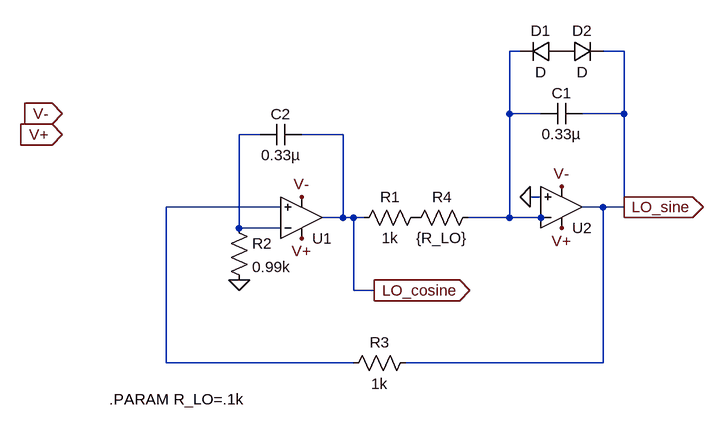
[diagram p0: schematic LocalOscillator.asc]
LocalOscillator.asc, the LTspice schematic file:
Version 4
SHEET 1 880 680
WIRE 448 -256 432 -256
WIRE 608 -256 576 -256
WIRE 432 -160 432 -256
WIRE 480 -160 432 -160
WIRE 608 -160 608 -256
WIRE 608 -160 544 -160
WIRE 48 -128 16 -128
WIRE 176 -128 112 -128
WIRE 480 -32 464 -32
WIRE 80 -16 -96 -16
WIRE 576 -16 544 -16
WIRE 608 -16 608 -160
WIRE 608 -16 576 -16
WIRE 176 0 176 -128
WIRE 176 0 144 0
WIRE 192 0 176 0
WIRE 208 0 192 0
WIRE 432 0 432 -160
WIRE 432 0 368 0
WIRE 480 0 480 -16
WIRE 480 0 432 0
WIRE 16 16 16 -128
WIRE 80 16 16 16
WIRE 192 112 192 0
WIRE 224 112 192 112
WIRE -96 224 -96 -16
WIRE 192 224 -96 224
WIRE 576 224 576 -16
WIRE 576 224 272 224
FLAG 16 96 0
FLAG 464 -32 0
FLAG 112 -32 V-
FLAG 512 -48 V-
FLAG 112 32 V+
FLAG 512 16 V+
FLAG 224 112 LO_cosine
IOPIN 224 112 Out
FLAG 608 -16 LO_sine
IOPIN 608 -16 Out
FLAG -256 -128 V+
IOPIN -256 -128 In
FLAG -256 -160 V-
IOPIN -256 -160 In
SYMBOL Opamps\\UniversalOpamp2 112 0 M180
SYMATTR InstName U1
SYMBOL res 304 -16 R90
WINDOW 0 0 56 VBottom 2
WINDOW 3 32 56 VTop 2
SYMATTR InstName R1
SYMATTR Value 1k
SYMBOL Opamps\\UniversalOpamp2 512 -16 M180
SYMATTR InstName U2
SYMBOL cap 544 -176 R90
WINDOW 0 0 32 VBottom 2
WINDOW 3 32 32 VTop 2
SYMATTR InstName C1
SYMATTR Value 0.33µ
SYMBOL diode 512 -272 R90
WINDOW 0 0 32 VBottom 2
WINDOW 3 32 32 VTop 2
SYMATTR InstName D1
SYMBOL diode 512 -240 R270
WINDOW 0 32 32 VTop 2
WINDOW 3 0 32 VBottom 2
SYMATTR InstName D2
SYMBOL cap 112 -144 R90
WINDOW 0 0 32 VBottom 2
WINDOW 3 32 32 VTop 2
SYMATTR InstName C2
SYMATTR Value 0.33µ
SYMBOL res 0 0 R0
SYMATTR InstName R2
SYMATTR Value 0.99k
SYMBOL res 288 208 R90
WINDOW 0 0 56 VBottom 2
WINDOW 3 32 56 VTop 2
SYMATTR InstName R3
SYMATTR Value 1k
SYMBOL res 384 -16 R90
WINDOW 0 0 56 VBottom 2
WINDOW 3 32 56 VTop 2
SYMATTR InstName R4
SYMATTR Value {R_LO}
TEXT -184 280 Left 2 !.PARAM R_LO=.1k

The netlist it stands for:
* LocalOscillator.asc
XU1 N003 N002 V+ V- LO_cosine level.2 Avol=1Meg GBW=10Meg Slew=10Meg ilimit=25m rail=0 Vos=0 phimargin=45 en=0 enk=0 in=0 ink=0 Rin=500Meg  ; pins IN+ IN- V+ V- OUT
R1 P001 LO_cosine 1k
XU2 0 N001 V+ V- LO_sine level.2 Avol=1Meg GBW=10Meg Slew=10Meg ilimit=25m rail=0 Vos=0 phimargin=45 en=0 enk=0 in=0 ink=0 Rin=500Meg  ; pins IN+ IN- V+ V- OUT
C1 LO_sine N001 0.33µ
D1 P002 N001 D
D2 P002 LO_sine D
C2 LO_cosine N002 0.33µ
R2 N002 0 0.99k
R3 LO_sine N003 1k
R4 N001 P001 {R_LO}
.model D D
.lib standard.dio
.PARAM R_LO=.1k
.lib UniversalOpamps2.sub
.backanno
.end